# EAGLE design V2_aktuell_StdTeile (EAGLE 6.5.0)
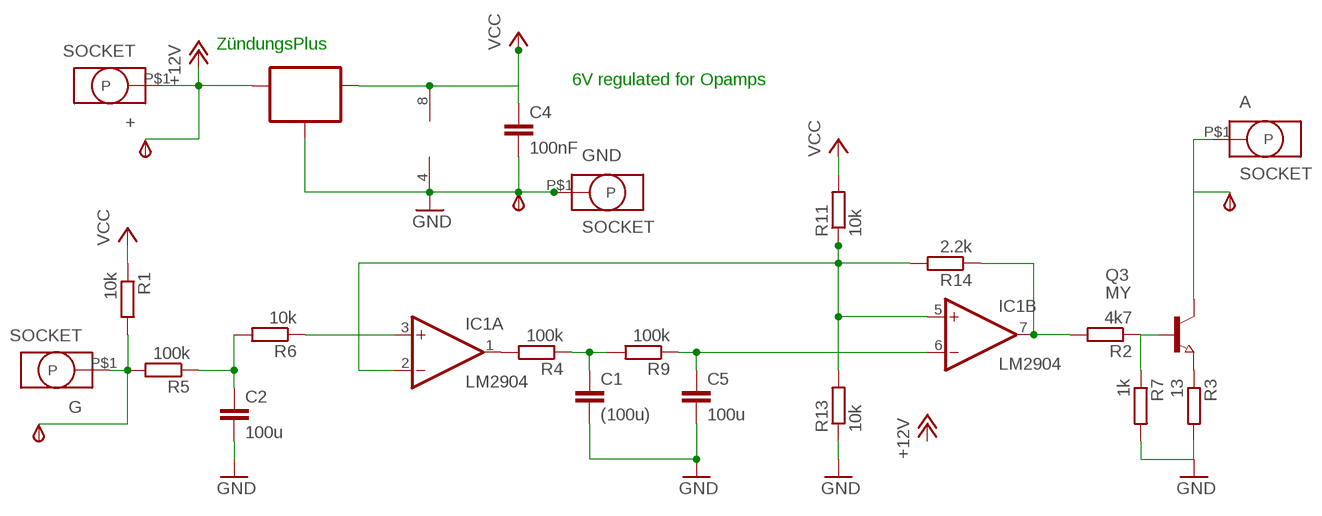
[diagram p0: schematic, sheet 1]

## Parts
+  SOCKET  [ID2.5MM]
A  SOCKET  [ID2.5MM]
C1  (100u)  C-EUC1206K  [C1206K]
C2  100u  C-EUC1206K  [C1206K]
C4  100nF  C-EUC0805  [C0805]
C5  100u  C-EUC1206K  [C1206K]
G  SOCKET  [ID2.5MM]
GND  SOCKET  [ID2.5MM]
GND_  TPSB2.0  [B2.0]
IC1  LM2904  LM358D  [SO08]
IC2  70L06  78LXXSOT89_ROUND  [SOT89_ROUND]
IN  TPSB2.0  [B2.0]
OUT  TPSB2.0  [B2.0]
Q3  MY  NPN-TRANSISTOR_SOT89  [SOT89]
R1  10k  R-EU_R0805  [R0805]
R2  4k7  R-EU_R0805  [R0805]
R3  13  R-EU_R1206  [R1206]
R4  100k  R-EU_R0805  [R0805]
R5  100k  R-EU_R0805  [R0805]
R6  10k  R-EU_R0805  [R0805]
R7  1k  R-EU_R0805  [R0805]
R9  100k  R-EU_R0805  [R0805]
R11  10k  R-EU_R0805  [R0805]
R13  10k  R-EU_R0805  [R0805]
R14  2.2k  R-EU_R0805  [R0805]
V+  TPSB2.0  [B2.0]

## Nets
+12V: +.P$1(P) IC2.3(IN) V+.TP(PP)
GND: C1.2 C2.2 C4.2 C5.2 GND.P$1(P) GND_.TP(PP) IC1.4(P:V-) IC2.2(GND) IC2.2@1(GND) R3.2 R7.2 R13.1
N$1: C2.1 R5.1 R6.2
N$2: Q3.1(B) R2.1 R7.1
N$3: C1.1 R4.1 R9.2
N$4: C5.1 IC1.6(B:-IN) R9.1
N$5: IC1.2(A:-IN) IC1.5(B:+IN) R11.1 R13.2 R14.2
N$6: G.P$1(P) IN.TP(PP) R1.2 R5.2
N$7: Q3.3(E) R3.1
N$9: IC1.3(A:+IN) R6.1
N$10: IC1.7(B:OUT) R2.2 R14.1
N$11: A.P$1(P) OUT.TP(PP) Q3.2(C)
N$580: IC1.1(A:OUT) R4.2
VCC: C4.1 IC1.8(P:V+) IC2.1(OUT) R1.1 R11.2

## Notes on the sheet
- ZündungsPlus
- 6V regulated for Opamps

## Library data of the parts
+ A G GND = Brotbox_Socket_Header:SOCKET
C1 C2 C4 C5 = rcl:C-EU: CAPACITOR, European symbol
GND_ IN OUT V+ = testpin_BMW:TPS: TEST PIN
IC1 = linear_BMW:LM358: OP AMP also LM158; LM258; LM2904 Source: http://cache.national.com/ds/LM/LM158.pdf
IC2 = 78LXX:78LXX
Q3 = Transistor_SOT89:NPN-TRANSISTOR_: NPN TRANSISTOR
R1-R7 R9 R11 R13 R14 = rcl:R-EU_: RESISTOR, European symbol

## Board
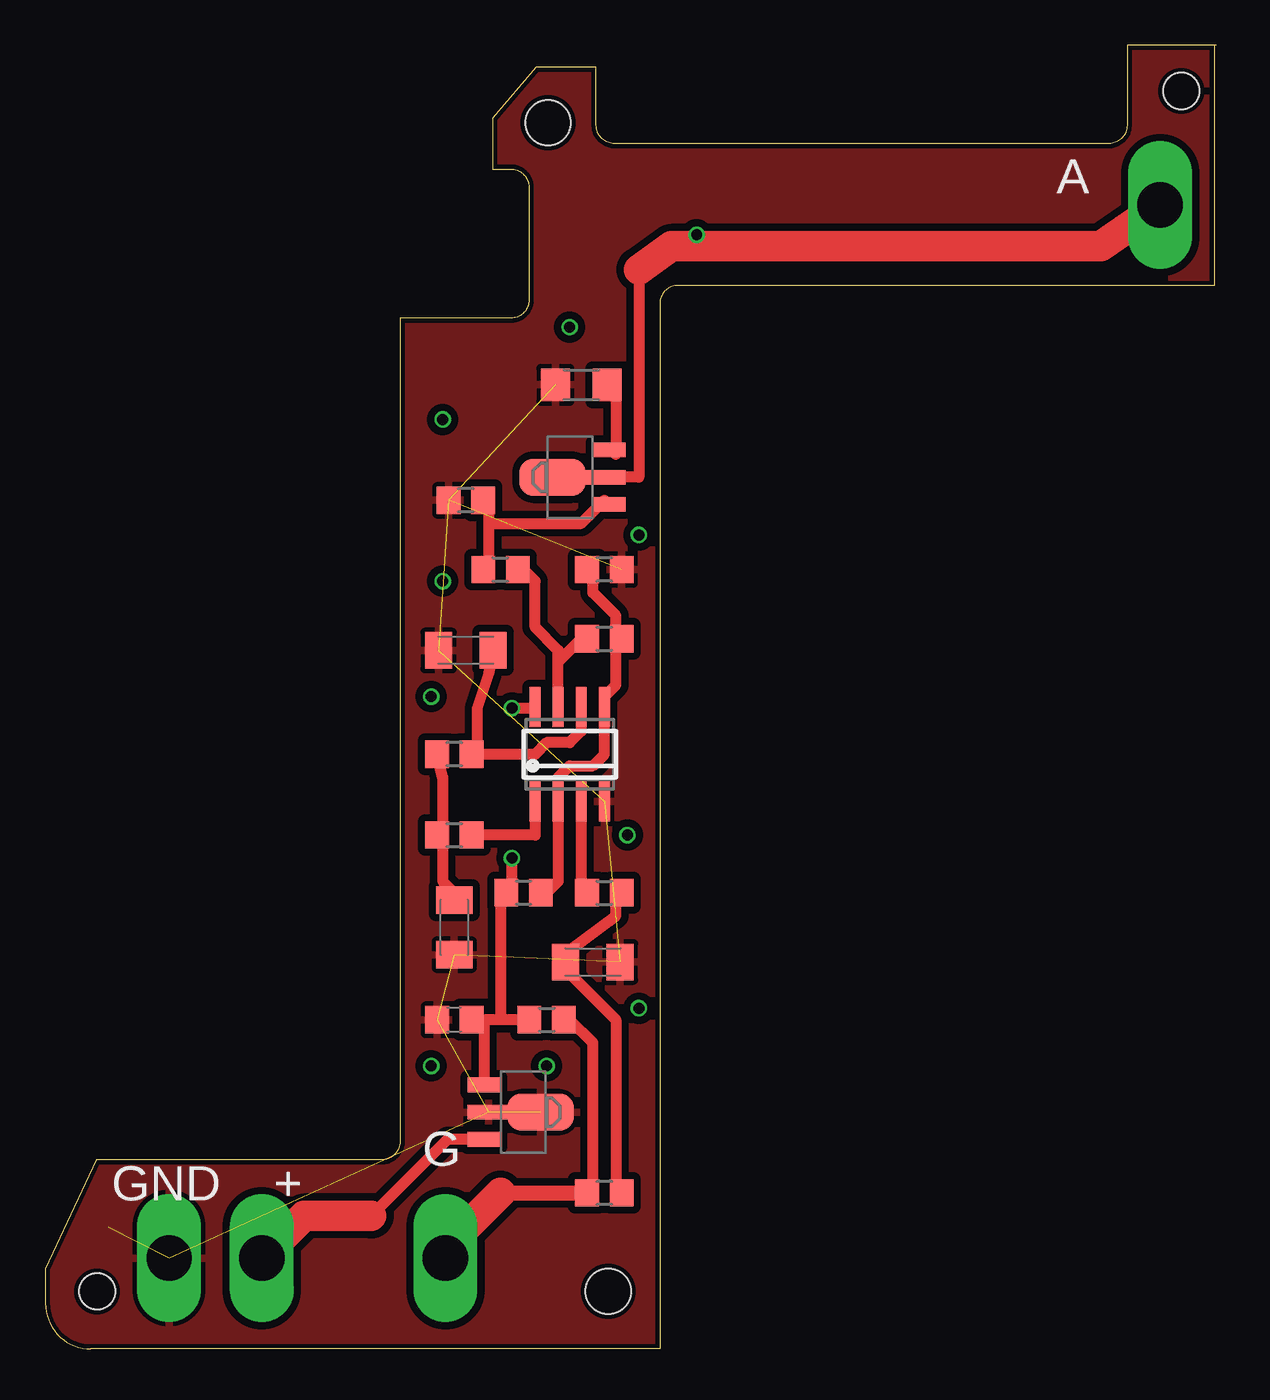
[diagram p1: board, top side]
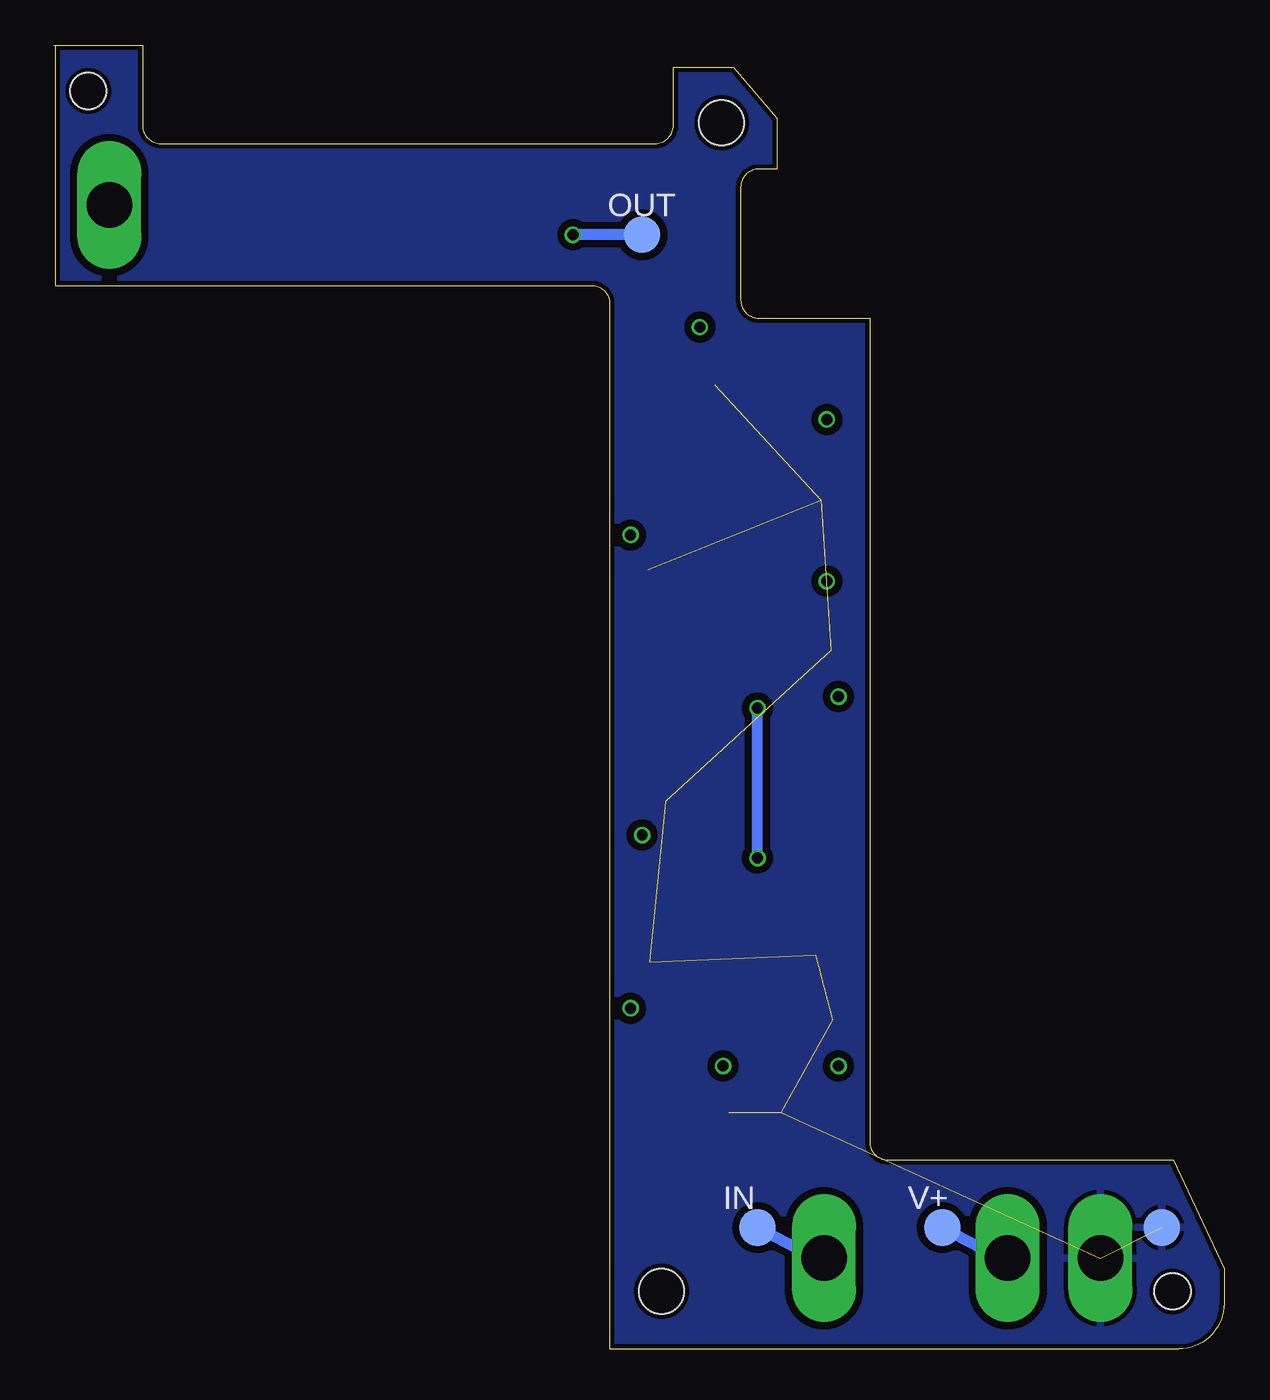
[diagram p2: board, bottom side, seen from below]

Size 64.4 x 71.7 mm. Coordinates in mm from the lower left corner, seen from the top.
Outline: 64.4,71.7 64.3,71.7
Outline: 64.3,71.7 59.5,71.7 59.5,67.3 arc-90 58.5,66.3 31.3,66.3 arc-90 30.3,67.3 30.3,70.5 27,70.5 24.6,67.7 24.6,64.9 25.6,64.9 arc-90 26.6,63.9 26.6,57.7 arc-90 25.6,56.7 19.5,56.7 19.5,11.4 arc-90 18.5,10.4 2.8,10.4 0,4.4 0,2.5 arc90 2.5,0 33.8,0 33.8,57.5 arc-90 34.8,58.5 64.3,58.5 64.3,71.7
Copper layers (1*16): Top 0.035mm / dielectric 1.5mm / Bottom 0.035mm
Design rules "SeeedStudio_2layer_DRU_no_angle_20140221 *": minimum track width 24mil, minimum drill 12mil, track to track 0.4mm, track to pad 0.4mm, pad to pad 0.4mm, via to via 0.4mm, smd to smd 0mil, copper to edge 10mil, drill to drill 10mil, minimum pad ring 10mil, minimum via ring 6mil, stop-mask expansion 2mil, vias tented up to drill 100mil, thermal gap 10mil
Holes 2.5 mm at 30.96,3.17 27.65,67.45
Holes 2 mm at 62.48,69.19 2.84,3.17

### Footprints (pad centres in the part's own frame; a part is rotated, then mirrored left to right if it is on the bottom)
ID2.5MM = drill 2.5 long: P$1 0,0
C1206K = smd 1.5 x 2: 1 -1.5,0; 2 1.5,0
C0805 = smd 1.3 x 1.5: 1 -0.95,0; 2 0.95,0
B2.0 = smd 2 x 2: TP 0,0
SO08 = smd 0.6 x 2.2: 1 -1.905,-2.6; 2 -0.635,-2.6; 3 0.635,-2.6; 4 1.905,-2.6; 5 1.905,2.6; 6 0.635,2.6; 7 -0.635,2.6; 8 -1.905,2.6
SOT89_ROUND = smd 0.8 x 1.8: 1 -1.499,-2.181; 3 1.499,-2.181 | smd 0.8 x 2.3: 2 0,-1.927 | smd 2.032 x 3.65: 2@1 0,0.94
SOT89 = smd 0.8 x 1.8: 1 -1.499,-2.181; 3 1.499,-2.181 | smd 0.8 x 2.3: 2 0,-1.927 | smd 2.032 x 3.65: 2@1 0,0.94
R0805 = smd 1.3 x 1.5: 1 -0.95,0; 2 0.95,0
R1206 = smd 1.6 x 1.803: 1 -1.422,0; 2 1.422,0

### Placement (x,y rotation side)
+  11.91,4.99 90 top
A  61.33,62.92 90 top
C1  22.49,23.19 270 top
C2  30.11,21.28 0 top
C4  22.49,18.11 180 top
C5  23.13,38.43 180 top
G  22.01,4.99 90 top
GND  6.81,4.99 90 top
GND_  3.44,6.67 0 bottom
IC1  28.84,32.71 0 top
IC2  26.3,13.03 270 top
IN  25.67,6.67 0 bottom
OUT  32.02,61.29 0 bottom
Q3  28.84,47.95 90 top
R1  27.57,18.11 0 top
R2  25.03,42.87 0 top
R3  29.48,53.03 180 top
R4  22.49,28.27 0 top
R5  30.75,8.58 180 top
R6  30.75,25.09 0 top
R7  23.13,46.68 180 top
R9  22.49,32.71 180 top
R11  26.3,25.09 180 top
R13  30.75,42.87 180 top
R14  30.75,39.06 0 top
V+  15.51,6.67 0 bottom

### Tracks (layer width: path | path; a pad name or v marks a point on that pad's centre or on a via)
+12V
  Top 0.61: IC2.3 22.13,11.53 17.92,7.31
  Top 1.676: 17.92,7.31 14.23,7.31 +.P$1
  Bottom 0.61: V+.TP 11.91,4.77 +.P$1
GND  (11 unrouted)
  pour Bottom: -0.37,-0.31 33.92,-0.31 33.92,58.36 64.4,58.36 64.4,72.72 25.67,72.72 18.68,56.84 18.68,13.66 16.78,11.12 0.27,11.12
  pour Top: -0.37,-0.31 33.92,-0.31 33.92,58.62 64.4,58.62 64.4,72.72 25.67,72.72 19.32,56.84 18.68,13.66 16.14,11.12 -0.37,11.12
N$1
  Top 0.61: 28.84,21.28 28.84,20.65 31.38,18.11 31.38,8.58 R5.1 | 28.84,21.28 28.84,21.92 31.38,23.82 31.38,25.09 R6.2 | 28.84,21.28 C2.1
N$2
  Top 0.61: 24.4,45.41 24.4,42.87 R2.1 | 24.4,45.41 24.4,46.68 R7.1 | 24.4,45.41 29.48,45.41 30.75,46.68 Q3.1
N$3
  Top 0.61: 21.86,28.27 21.86,31.44 R9.2 | 21.86,28.27 21.86,25.73 22.49,25.09 C1.1 | 21.86,28.27 R4.1
N$4
  Top 0.61: IC1.6 29.48,33.98 28.84,33.35 27.57,33.35 26.94,32.71 R9.1 23.76,33.35 23.76,35.25 24.4,37.16 C5.1
N$5
  Top 0.61: R11.1 27.57,25.09 28.21,25.73 IC1.2 28.21,31.44 28.84,32.08 30.11,32.08 30.75,32.71 IC1.5 30.75,35.89 31.38,36.52 31.38,39.06 | 31.38,39.06 31.38,40.33 30.11,41.6 30.11,42.87 R13.2 | 31.38,39.06 R14.2
N$6
  Top 0.61: R1.2 28.84,18.11 30.11,16.84 30.11,8.58 R5.2
  Top 0.813: 25.03,8.58 R5.2
  Top 1.676: G.P$1 22.01,5.56 25.03,8.58
  Bottom 0.61: IN.TP 22.01,4.77 G.P$1
N$7
  Top 0.61: Q3.3 31.38,49.22 31.38,53.03 R3.1
N$8  (via drill 0.6)
  other vias: 27.57,15.56
N$9
  Top 0.61: IC1.3 29.48,25.09 R6.1
N$10
  Top 0.61: IC1.7 28.21,37.79 | 28.21,37.79 28.21,38.43 26.94,39.7 26.94,42.23 26.3,42.87 R2.2 | 28.21,37.79 29.48,39.06 R14.1
N$11  (via drill 0.6)
  Top 0.61: Q3.2 32.65,47.95 32.65,59.38 | v35.83,61.29 35.83,60.65
  Top 1.676: A.P$1 58.05,60.65 35.83,60.65 34.43,60.65 32.65,59.38
  Bottom 0.61: OUT.TP v35.83,61.29
N$12  (via drill 0.6)
  other vias: 32.02,28.27
N$13  (via drill 0.6)
  other vias: 21.86,42.23
N$14  (via drill 0.6)
  other vias: 21.86,51.12
N$15  (via drill 0.6)
  other vias: 28.84,56.2
N$16  (via drill 0.6)
  other vias: 32.65,44.78
N$17  (via drill 0.6)
  other vias: 32.65,18.74
N$18  (via drill 0.6)
  other vias: 21.22,15.56
N$19  (via drill 0.6)
  other vias: 21.22,35.89
N$580
  Top 0.61: R4.2 26.94,28.27 IC1.1
VCC  (via drill 0.6)
  Top 0.61: C4.1 24.12,18.11 | 24.12,18.11 IC2.1 | R1.1 25.03,18.11 | 25.03,18.11 24.12,18.11 | 25.03,18.11 25.03,25.09 R11.2 25.67,25.09 v25.67,27 | v25.67,35.25 26.88,35.25 IC1.8
  Bottom 0.61: v25.67,27 v25.67,35.25